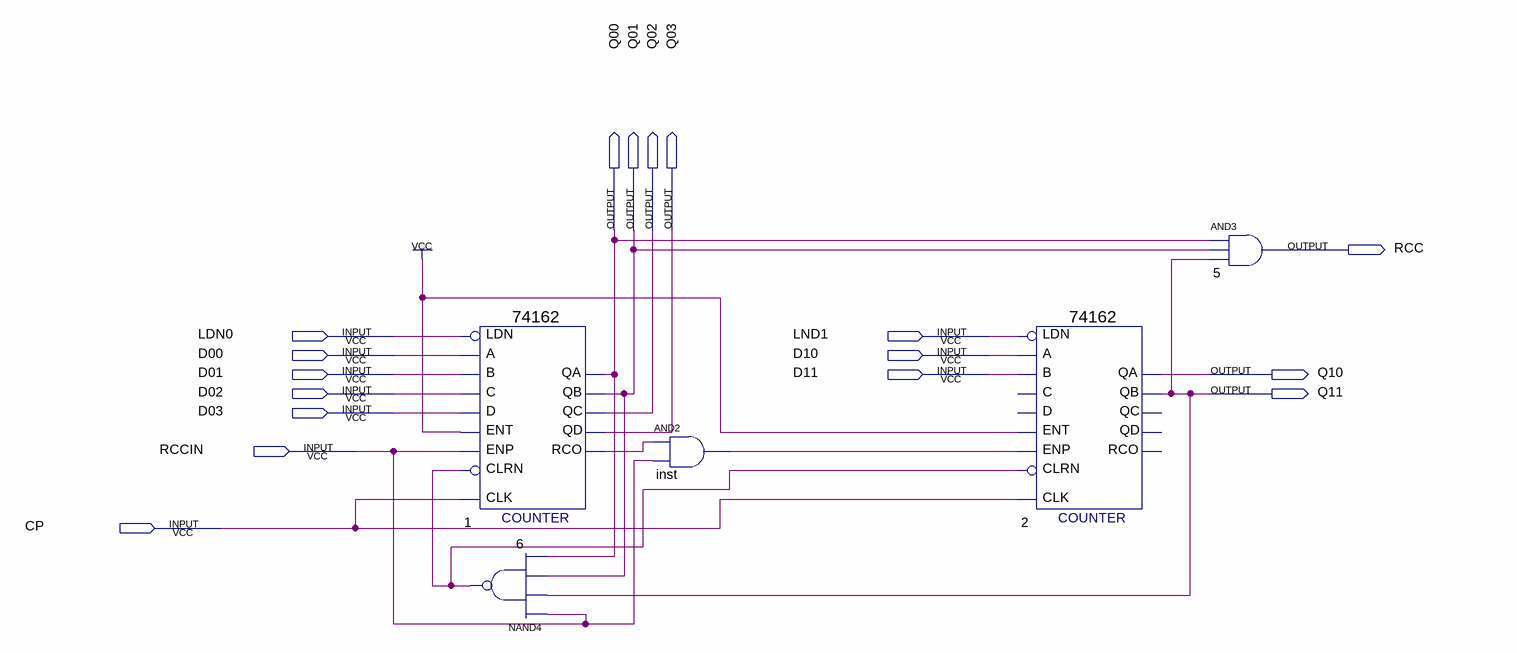
[diagram p0: schematic sheet]
// Quartus schematic 24Counter.bdf as structural Verilog: 5 symbols, 17 pins
module \24Counter  (
  input  LDN0,
  input  LND1,
  input  D00,
  input  D10,
  input  D01,
  input  D11,
  input  D02,
  input  D03,
  input  RCCIN,
  input  CP,
  output Q00,
  output Q01,
  output Q02,
  output Q03,
  output RCC,
  output Q10,
  output Q11
);

  wire inst_out, n1_rco, n6_out;

  \74162  u_1 (
    .A(D00), .LDN(LDN0), .B(D01), .C(D02), .D(D03), .ENP(RCCIN), .ENT(1'b1), .CLRN(n6_out), .CLK(CP),
    .QA(Q00), .QB(Q01), .QC(Q02), .QD(Q03), .RCO(n1_rco));
  nand u_6 (n6_out, RCCIN, Q11, Q01, Q00);
  and inst (inst_out, n1_rco, RCCIN);
  \74162  u_2 (
    .A(D10), .LDN(LND1), .B(D11), .ENP(inst_out), .ENT(1'b1), .CLRN(n6_out), .CLK(CP), .QA(Q10), .QB(Q11));  // open: C, D, QC, QD, RCO
  and u_5 (RCC, Q00, Q01, Q11);
endmodule
